# EAGLE design PowerCOnverter_v1.0 (EAGLE 8.0.0)
CNAME: ARL; DESIGNER: SHRIYA SHAH

## Sheet 1 of 2
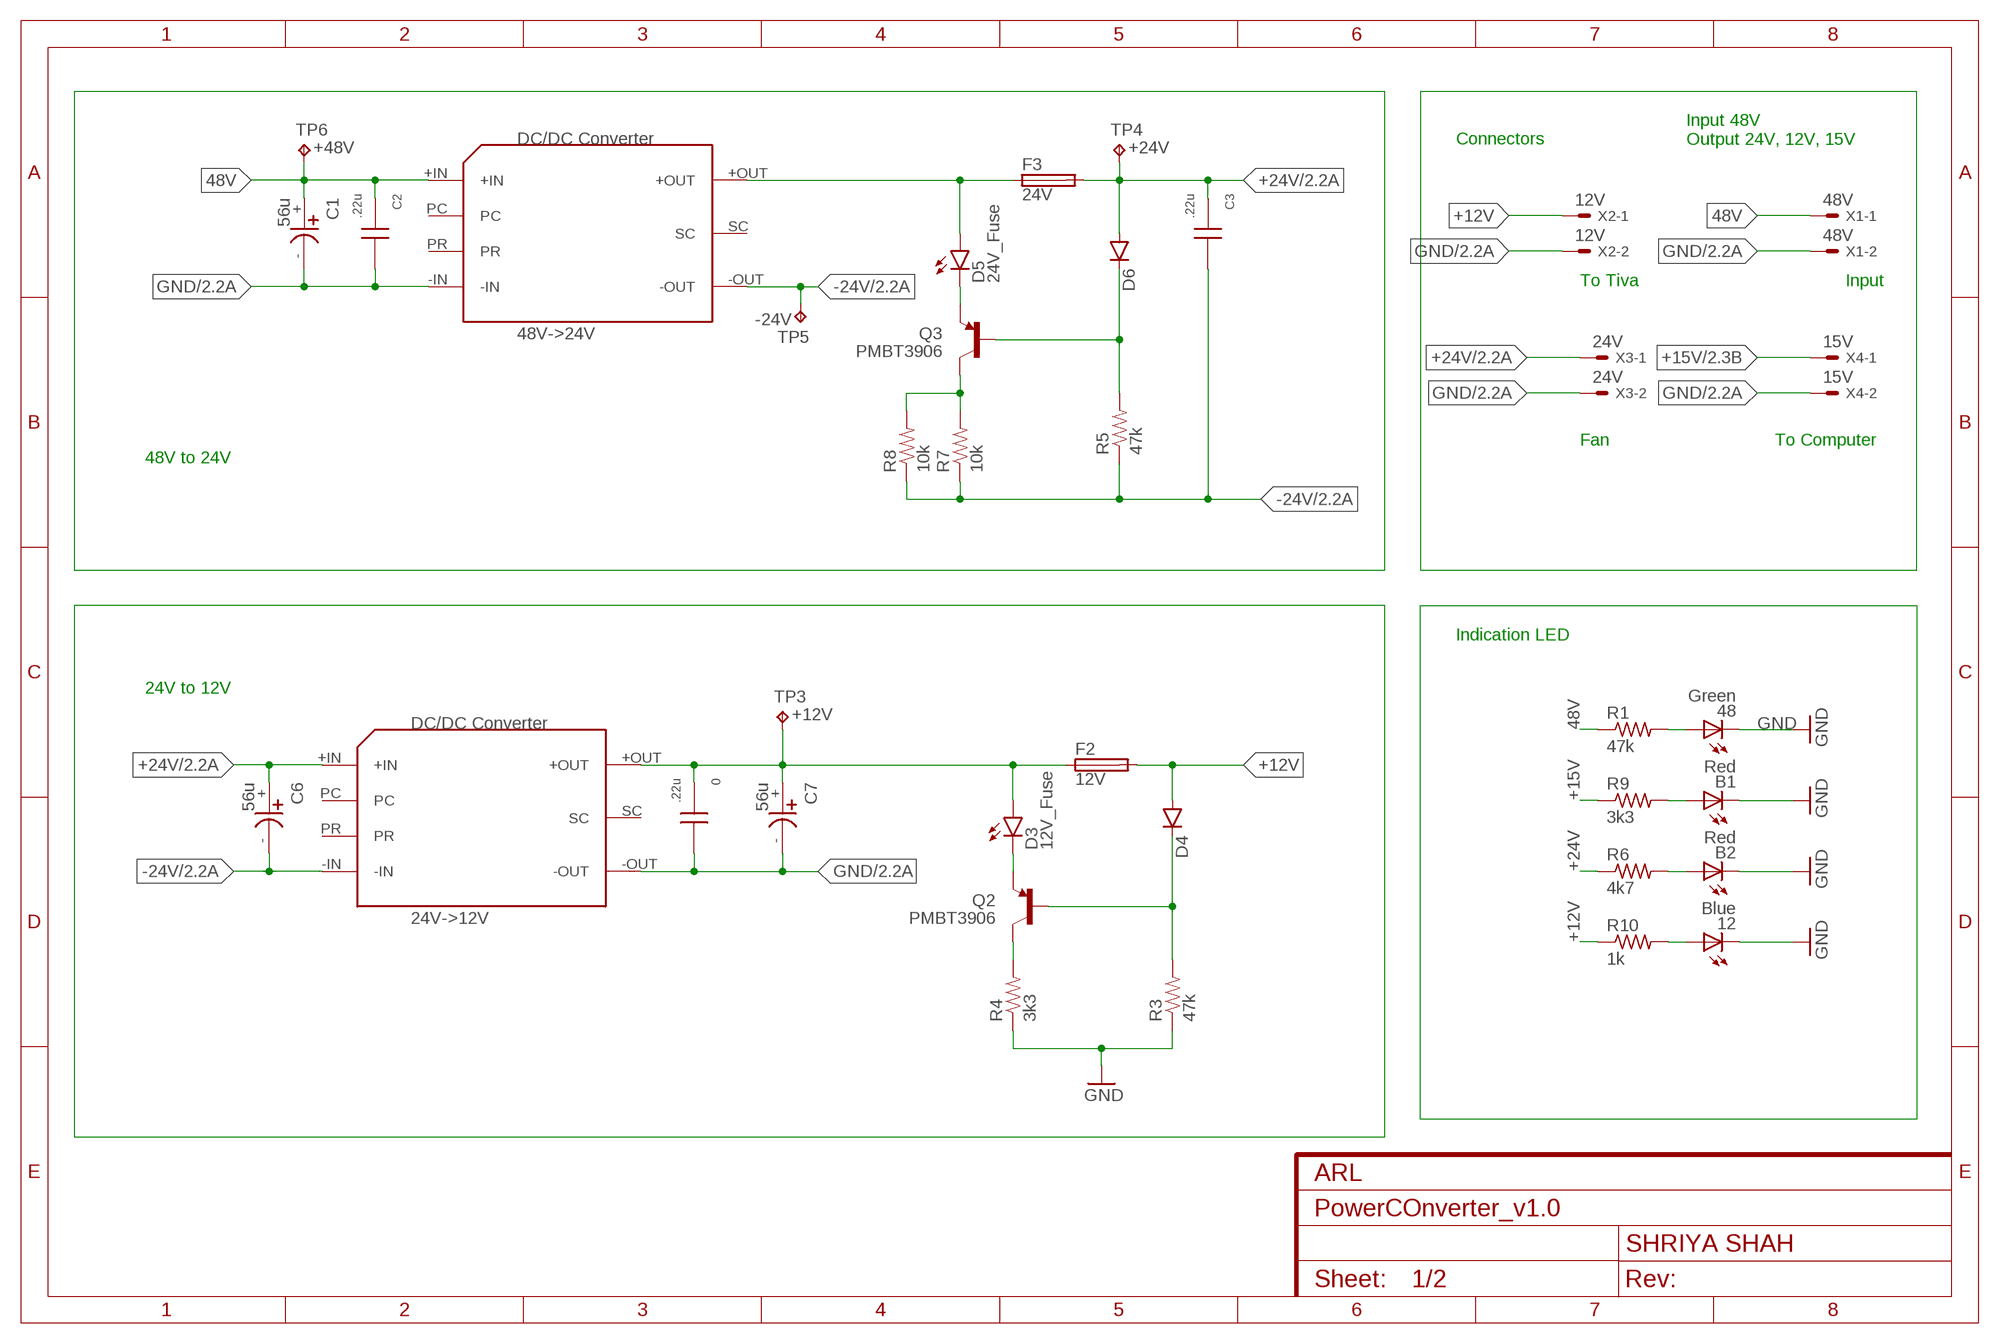
[diagram p0: schematic, sheet 1]

### Parts
0  .22u  .22U_100VDC_CERAMIC_CAP  [CERAMIC_CAP_5MM-LEAD]
12  Blue  LEDCHIPLED_1206  [CHIPLED_1206]
48  Green  LEDCHIPLED_1206  [CHIPLED_1206]
B1  Red  LEDCHIPLED_1206  [CHIPLED_1206]
B2  Red  LEDCHIPLED_1206  [CHIPLED_1206]
C1  56u  56U_100VDC_NICHICON  [CAP_5MM-LEAD-10MM-D]
C2  .22u  .22U_100VDC_CERAMIC_CAP  [CERAMIC_CAP_5MM-LEAD]
C3  .22u  .22U_100VDC_CERAMIC_CAP  [CERAMIC_CAP_5MM-LEAD]
C6  56u  56U_100VDC_NICHICON  [CAP_5MM-LEAD-10MM-D]
C7  56u  56U_100VDC_NICHICON  [CAP_5MM-LEAD-10MM-D]
D3  12V_Fuse  RED_LED_0603  [LED-0603]
D4  DIODESOD  [SOD-323]
D5  24V_Fuse  RED_LED_0603  [LED-0603]
D6  DIODESOD  [SOD-323]
F2  12V  FUSELITTLEFUSE_NANO  [LITTELFUSE_NANO]
F3  24V  FUSELITTLEFUSE_NANO  [LITTELFUSE_NANO]
PS1  48V->24V  VICOR_MICRO_DC/DC_24V  [VICOR_MICRO_DC/DC_CONVERTER]
PS2  24V->12V  VICOR_MICRO_DC/DC_12V  [VICOR_MICRO_DC/DC_CONVERTER]
Q2  PMBT3906  TRANSISTOR_PNPPMBT3906  [SOT23-3]
Q3  PMBT3906  TRANSISTOR_PNPPMBT3906  [SOT23-3]
R1  47k  R-US_M1206  [M1206]
R3  47k  47K_RESISTOR_0603  [0603-RES]
R4  3k3  3K3_RESISTOR_0603  [0603-RES]
R5  47k  47K_RESISTOR_0603  [0603-RES]
R6  4k7  R-US_M1206  [M1206]
R7  10k  10K_RESISTOR_0603  [0603-RES]
R8  10k  10K_RESISTOR_0603  [0603-RES]
R9  3k3  R-US_M1206  [M1206]
R10  1k  R-US_M1206  [M1206]
TP3  +12V  TP5000  [5000_SERIES_TESTPOINT]
TP4  +24V  TP5000  [5000_SERIES_TESTPOINT]
TP5  -24V  TP5000  [5000_SERIES_TESTPOINT]
TP6  +48V  TP5000  [5000_SERIES_TESTPOINT]
X1  48V  5566-2  [5566-2]
X2  12V  5566-2  [5566-2]
X3  24V  5566-2  [5566-2]
X4  15V  5566-2  [5566-2]

### Nets
48V: C1.+ C2.1 PS1.+IN R1.1 TP6.P$1(TP) X1.1
+12V: D4.A F2.2 R10.1 X2.1
+15V: R9.1 X4.1 ; also sheet 2
+24V: C3.1 C6.+ D6.A F3.2 PS2.+IN R6.1 TP4.P$1(TP) X3.1 ; also sheet 2
-24V: C3.2 C6.- PS1.-OUT PS2.-IN R5.1 R7.1 R8.1 TP5.P$1(TP) ; also sheet 2
GND: 0.2 12.C 48.C B1.C B2.C C1.- C2.2 C7.- PS1.-IN PS2.-OUT R3.1 R4.1 X1.2 X2.2 X3.2 X4.2 ; also sheet 2
N$1: D5.C Q3.2(E)
N$3: D5.A F3.1 PS1.+OUT
N$6: Q3.3(C) R7.2 R8.2
N$7: 48.A R1.2
N$8: 0.1 C7.+ D3.A F2.1 PS2.+OUT TP3.P$1(TP)
N$9: D3.C Q2.2(E)
N$10: Q2.3(C) R4.2
N$11: D4.C Q2.1(B) R3.2
N$12: D6.C Q3.1(B) R5.2
N$13: B1.A R9.2
N$14: B2.A R6.2
N$15: 12.A R10.2
Unconnected: PS1.PC PS1.PR PS1.SC PS2.PC PS2.PR PS2.SC

### Notes on the sheet
- Connectors
- Input 48V
  Output 24V, 12V, 15V
- To Tiva | Input
- Fan | To Computer
- 48V to 24V
- Indication LED
- 24V to 12V

## Sheet 2 of 2
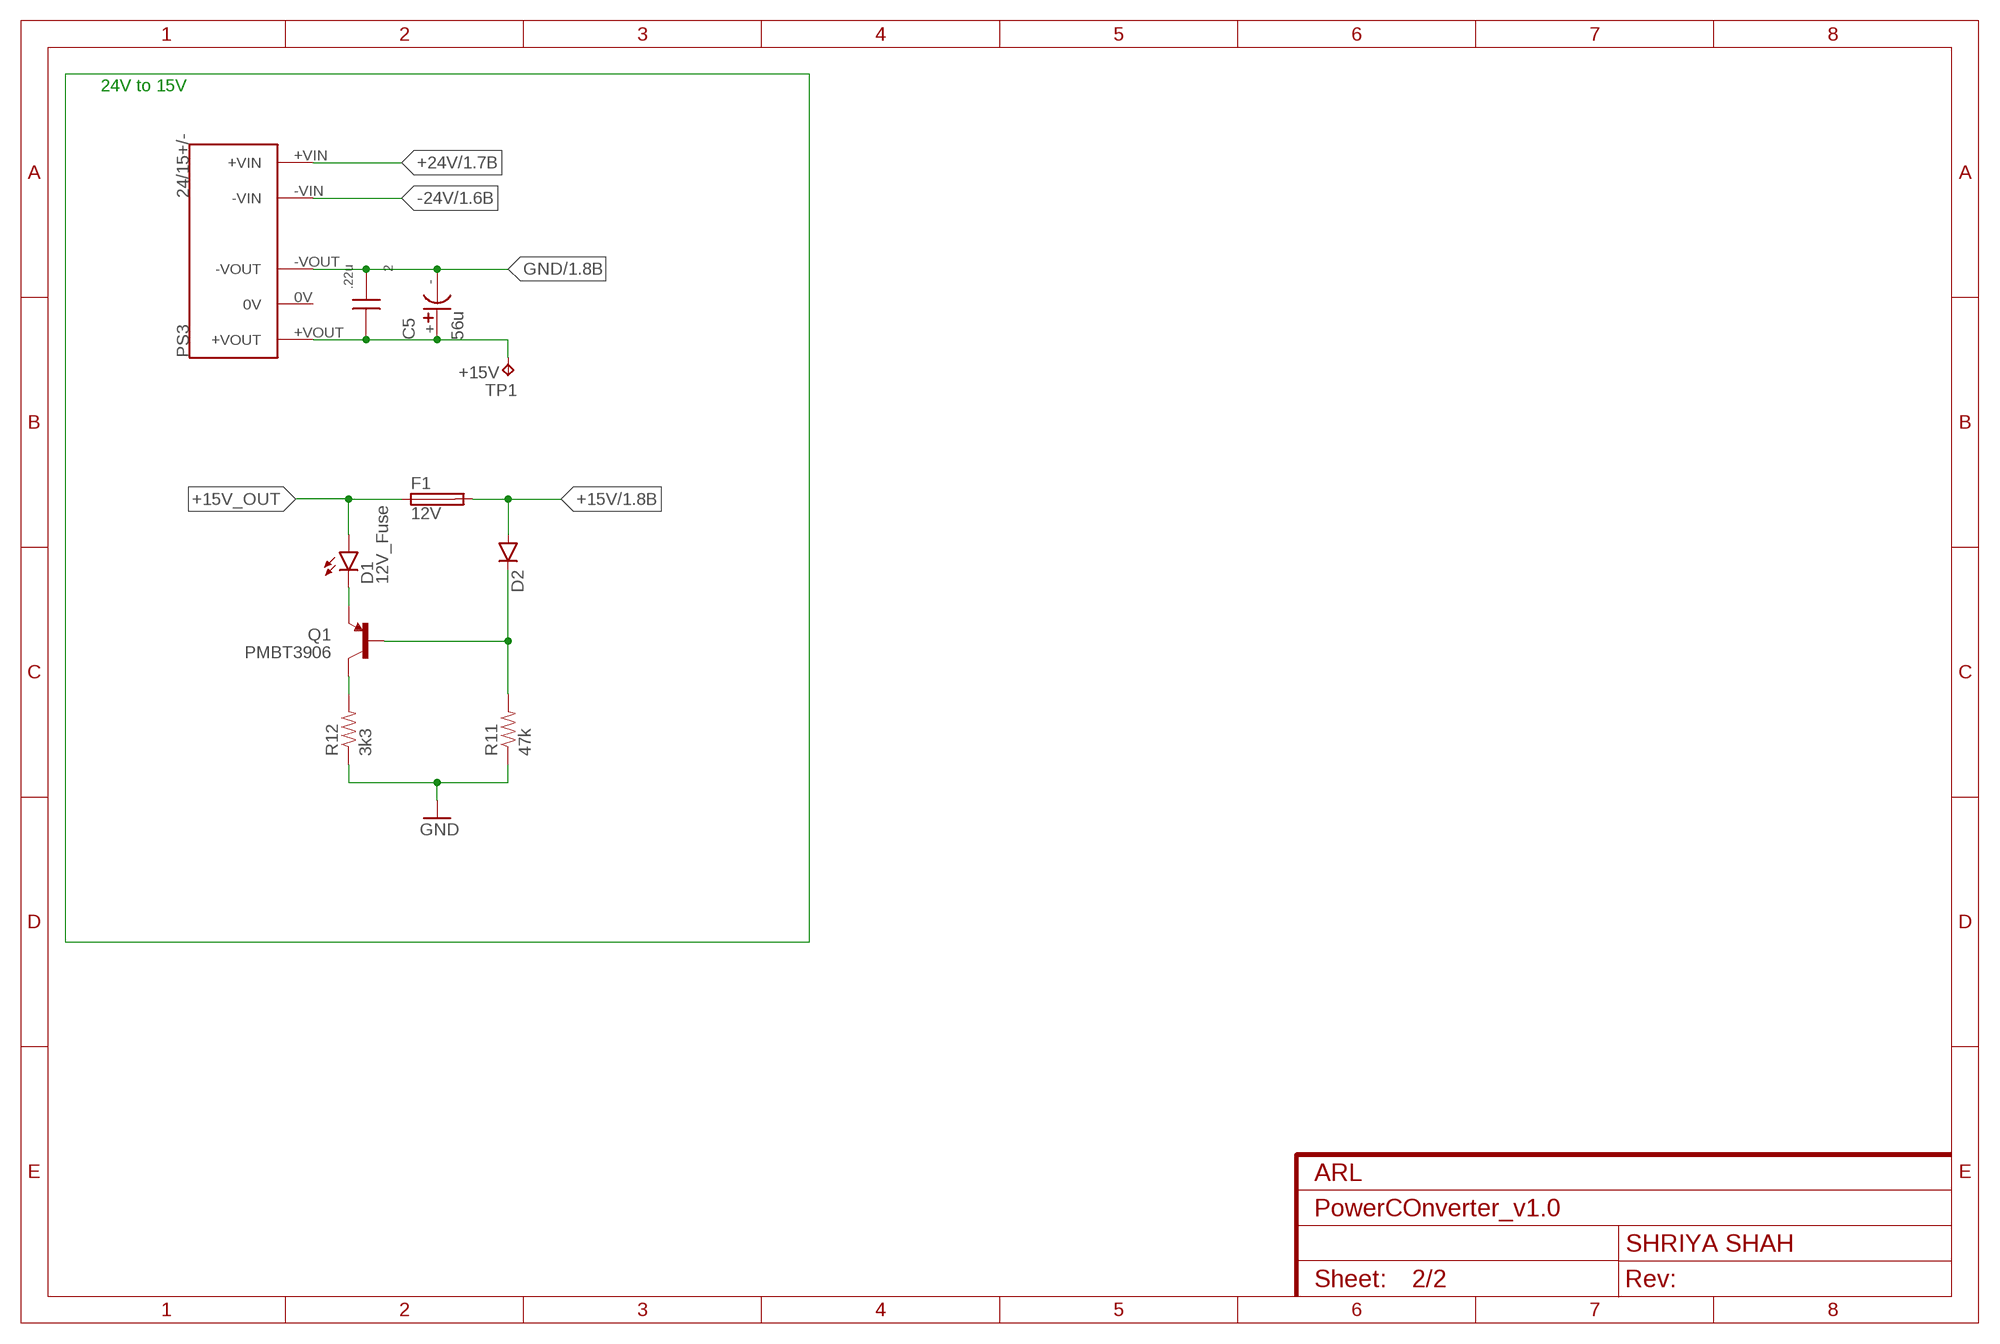
[diagram p1: schematic, sheet 2]

### Parts
2  .22u  .22U_100VDC_CERAMIC_CAP  [CERAMIC_CAP_5MM-LEAD]
C5  56u  56U_100VDC_NICHICON  [CAP_5MM-LEAD-10MM-D]
D1  12V_Fuse  RED_LED_0603  [LED-0603]
D2  DIODESOD  [SOD-323]
F1  12V  FUSELITTLEFUSE_NANO  [LITTELFUSE_NANO]
PS3  24/15+/-  MURATA_NMH2415SC  [MURATA_NMH]
Q1  PMBT3906  TRANSISTOR_PNPPMBT3906  [SOT23-3]
R11  47k  47K_RESISTOR_0603  [0603-RES]
R12  3k3  3K3_RESISTOR_0603  [0603-RES]
TP1  +15V  TP5000  [5000_SERIES_TESTPOINT]

### Nets
+15V: D2.A F1.2 ; also sheet 1
+15V_OUT: 2.2 C5.+ D1.A F1.1 PS3.+VOUT TP1.P$1(TP)
+24V: PS3.+VIN ; also sheet 1
-24V: PS3.-VIN ; also sheet 1
GND: 2.1 C5.- PS3.-VOUT R11.1 R12.1 ; also sheet 1
N$18: D1.C Q1.2(E)
N$19: Q1.3(C) R12.2
N$20: D2.C Q1.1(B) R11.2
Unconnected: PS3.0V

### Notes on the sheet
- 24V to 15V

## Library data of the parts
0 2 C2 C3 = Capacitor-IHMC:.22U_100VDC_CERAMIC_CAP: 0.22µF ±10% 100V X7R Ceramic Capacitor -55°C ~ 125°C Through Hole Radial 0.217" L x 0.138" W (5.50mm x 3.50mm); MPN: FK26X7R2A224K
12 48 B1 B2 = adafruit:LED: LED OSRAM: - CHIPLED LG R971, LG N971, LY N971, LG Q971, LY Q971, LO R971, LY R971 LH N974, LH R974 LS Q976, LO Q976, LY Q976 LO Q996 - Hyper CHIPLED LW Q18S LB Q993, LB Q99A, LB R99A - SideLED LS A670, LO A670, LY A670, LG A670, LP A670 LB A673, LV A673, LT A673, LW A673 LH A674 LY A675 LS A676, LA A676, LO A676, LY A676, LW A676 LS A679, LY A679, LG A679 - Hyper Micro SIDELED® LS Y876, LA Y876, LO Y876, LY Y876 LT Y87S - SmartLED LW L88C, LW L88S LB L89C, LB L89S, LG L890 LS L89K, LO L89K, LY L89K LS L896, LA L896, LO L896, LY L896 - TOPLED LS T670, LO T670, LY T670, LG T670, LP T670 LSG T670, LSP T670, LSY T670, LOP T670, LYG T670 LG T671, LOG T671, LSG T671 LB T673, LV T673, LT T673, LW T673 LH T674 LS T676, LA T676, LO T676, LY T676, LB T676, LH T676, LSB T676, LW T676 LB T67C, LV T67C, LT T67C, LS T67K, LO T67K, LY T67K, LW E67C LS E67B, LA E67B, LO E67B, LY E67B, LB E67C, LV E67C, LT E67C LW T67C LS T679, LY T679, LG T679 LS T770, LO T770, LY T770, LG T770, LP T770 LB T773, LV T773, LT T773, LW T773 LH T774 LS E675, LA E675, LY E675, LS T675 LS T776, LA T776, LO T776, LY T776, LB T776 LHGB T686 LT T68C, LB T68C - Hyper Mini TOPLED® LB M676 - Mini TOPLED Santana® LG M470 LS M47K, LO M47K, LY M47K Source: http://www.osram.convergy.de/
C1 C5-C7 = Capacitor-IHMC:56U_100VDC_NICHICON: Aluminum Electrolytic Capacitors - Leaded 56uF 105c 20%; LINK: http://bit.ly/1Y6Cm3r; MPN: UPJ2A560MPD1TD
D1 D3 D5 = test_Beast_Elmo_Twitter_Carrier_Board_V1:RED_LED_0603: LED RED DIFFUSED 0603 SMD; MPN: LS L296-P2Q2-1-Z
D2 D4 D6 = SparkFun-DiscreteSemi:DIODE: Diode These are standard reverse protection diodes and small signal diodes. SMA package can handle up to about 1A. SOD-323 can handle about 200mA. What the SOD-323 package when ordering, there are some mfgs out there that are 5-pin packages.; MPN: BAS16HT1G; PROD_ID: DIO-09646
F1-F3 = fuse:FUSE: Fuse Fuse Holder ACS NANO HLDR; MPN: 01550900M
PS1 = Vicor:VICOR_MICRO_DC/DC_24V: Isolated DC/DC Converters 24V 150W; MPN: V48C24C150BL
PS2 = Vicor:VICOR_MICRO_DC/DC_12V: Isolated DC/DC Converters Micro Family-Vin-24, Vout-12, Power-100; MPN: V24C12T100BL
PS3 = test_Beast_Elmo_Twitter_Carrier_Board_V1:MURATA_NMH2415SC: CONV DC/DC 2W 24VIN 15V SIP DL; MPN: NMH2415SC
Q1-Q3 = SparkFun-DiscreteSemi:TRANSISTOR_PNP: Generic PNP BJT Double check pinouts against datasheets- not all devices are the same! MMBT3906 - 40V 200mA SOT-23 (TRANS-08052) MMBT4403 - 40V 600mA SOT-23 (TRANS-09245); MPN: PMBT3906,215; PROD_ID: TRANS-08052
R1 R6 R9 R10 = adafruit:R-US_: RESISTOR, American symbol
R3 R5 R11 = test_Beast_Elmo_Twitter_Carrier_Board_V1:47K_RESISTOR_0603: RES SMD 47K OHM 5% 1/10W 0603; MPN: CRCW060347K0JNEA
R4 R12 = test_Beast_Elmo_Twitter_Carrier_Board_V1:3K3_RESISTOR_0603: RES SMD 3.3K OHM 1% 1/10W 0603; MPN: CRCW06033K30FKEA
R7 R8 = test_Beast_Elmo_Twitter_Carrier_Board_V1:10K_RESISTOR_0603: RES SMD 10K OHM 1% 1/10W 0603; MPN: CRCW060310K0FKEA
TP1 TP3-TP6 = testpad:TP: Test pad; COLOR: White; MPN: 5002
X1-X4 = con-molex:5566-2: Mini FIT connector 2 pol Source: http://www.molex.com; MF: Molex; MPN: 39-29-9023

## Board
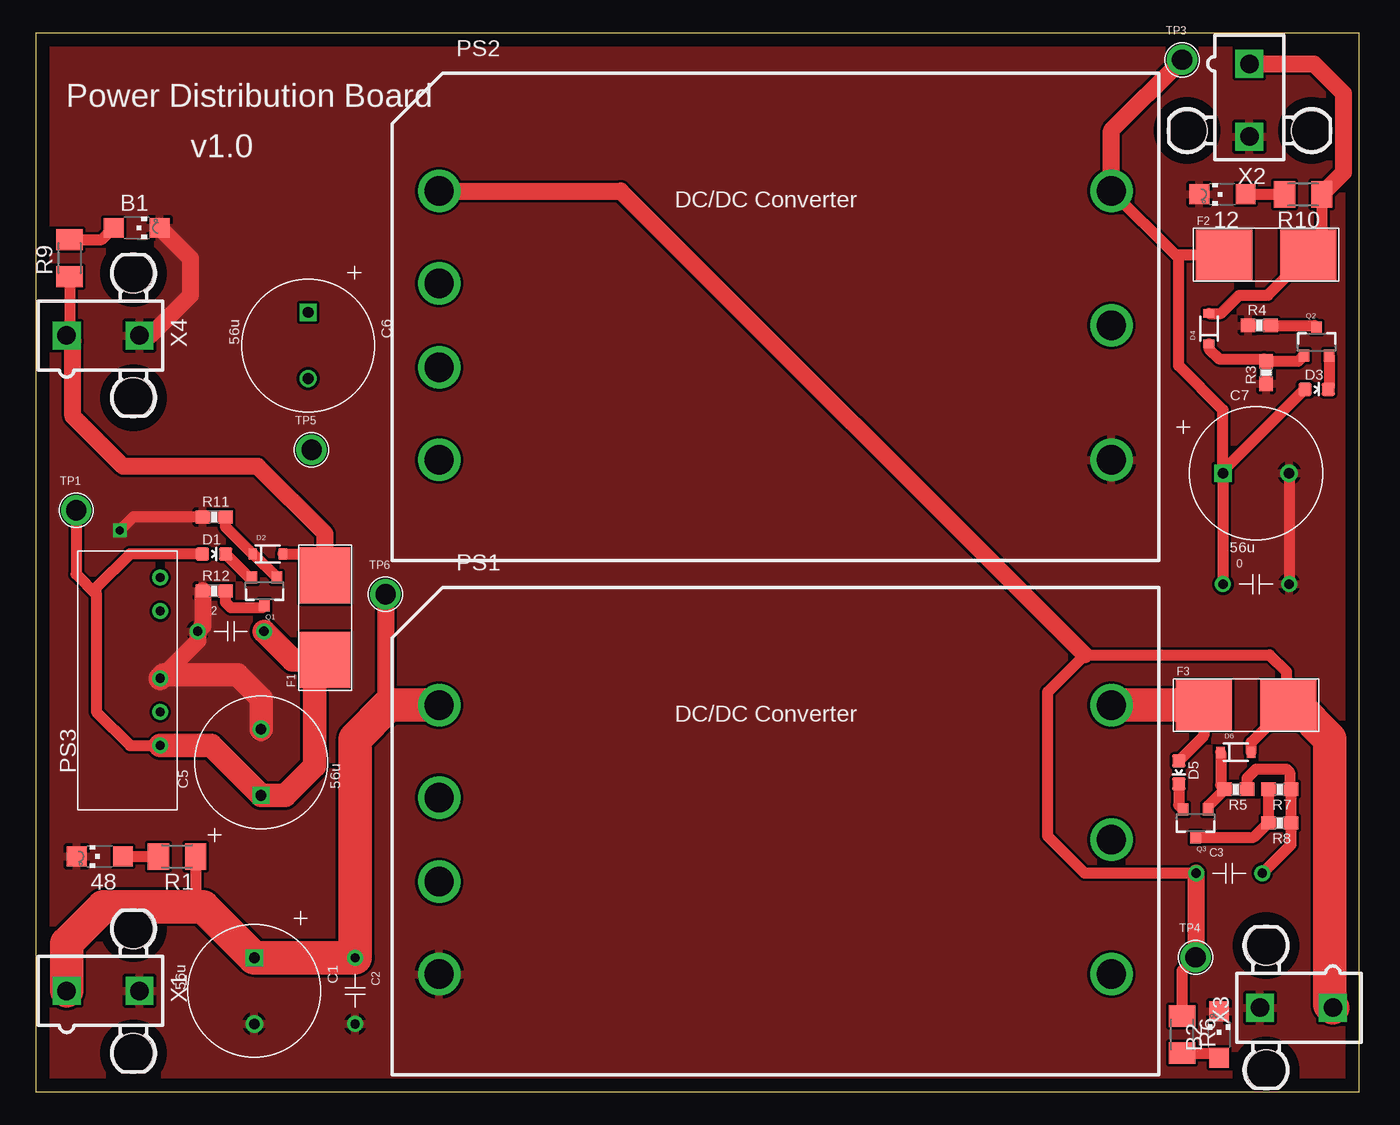
[diagram p2: board, top side]
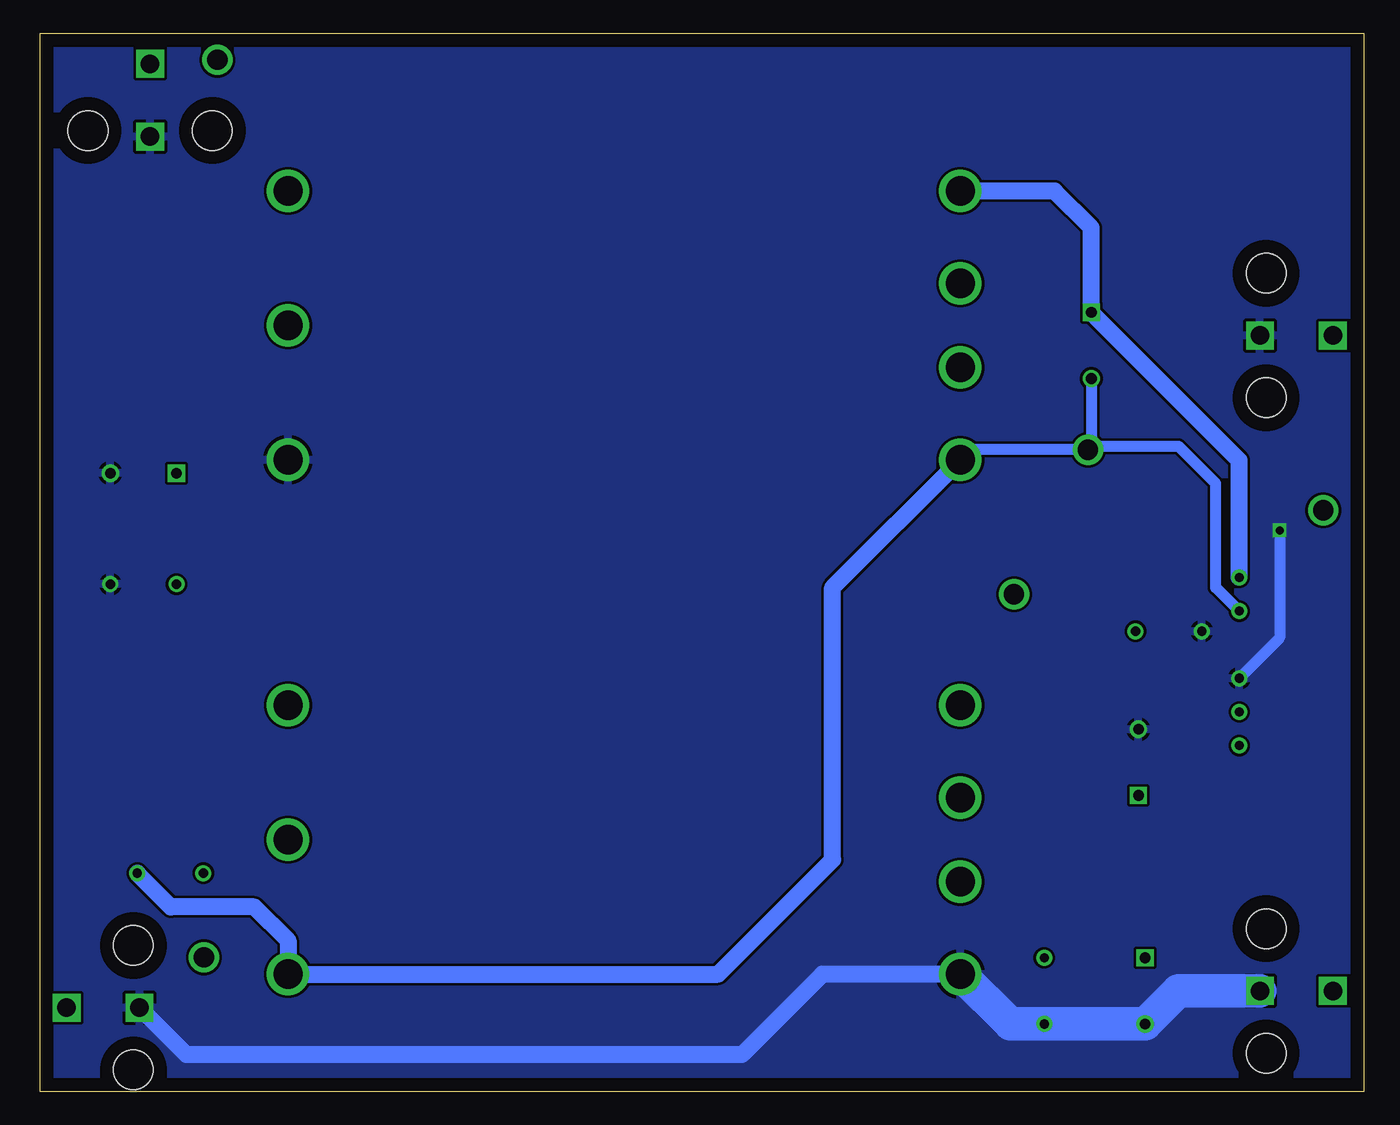
[diagram p3: board, bottom side, seen from below]

Size 100 x 80 mm. Coordinates in mm from the lower left corner, seen from the top.
Outline: 0,0 100,0 100,80 0,80 0,0
Copper layers (1*16): Top 0.035mm / dielectric 1.5mm / Bottom 0.035mm
Design rules "default": minimum track width 10mil, minimum drill 24mil, track to track 8mil, track to pad 8mil, pad to pad 8mil, via to via 8mil, smd to smd 8mil, copper to edge 40mil, drill to drill 8mil, minimum pad ring 10mil, minimum via ring 8mil, stop-mask expansion 4mil, vias tented up to drill 0mil, thermal gap 10mil

### Footprints (pad centres in the part's own frame; a part is rotated, then mirrored left to right if it is on the bottom)
CERAMIC_CAP_5MM-LEAD = drill 0.7: 1 -2.5,0; 2 2.5,0
CHIPLED_1206 = smd 1.5 x 1.5: A 0,-1.75; C 0,1.75
CAP_5MM-LEAD-10MM-D = drill 0.8 square: + -2.5,0 | drill 0.8: - 2.5,0
LED-0603 = smd 1 x 1: A 0,-0.877; C 0,0.877
SOD-323 = smd 0.63 x 0.83: A 1.15,0; C -1.15,0
LITTELFUSE_NANO = smd 4.245 x 3.81: 1 -3.188,0; 2 3.188,0
VICOR_MICRO_DC/DC_CONVERTER = drill 2.2: +IN 0,20.32; +OUT 50.8,20.32; -IN 0,0; -OUT 50.8,0; PC 0,13.335; PR 0,6.985; SC 50.8,10.16
MURATA_NMH = drill 0.7: 0V 10.16,0; +VIN 0,0; +VOUT 12.7,0; -VIN 2.54,0; -VOUT 7.62,0
SOT23-3 = smd 0.8 x 0.9: 1 -0.95,-1; 2 0.95,-1; 3 0,1.1
M1206 = smd 1.6 x 2: 1 -1.4,0; 2 1.4,0
0603-RES = smd 1.1 x 1: 1 -0.85,0; 2 0.85,0
5000_SERIES_TESTPOINT = drill 1.524 pad 2.032: P$1 0,0
5566-2 = drill 1.4 square: 1 0,-2.75; 2 0,2.75 | hole 3: 4.7,2.29; -4.7,2.29

### Placement (x,y rotation side)
0  92.2,38.35 0 top
2  14.73,34.8 0 top
12  89.66,67.82 90 top
48  4.83,17.78 90 top
B1  7.62,65.28 270 top
B2  89.41,4.32 0 top
C1  16.51,7.62 270 top
C2  24.13,7.62 270 top
C3  90.17,16.51 0 top
C5  17.02,24.89 90 top
C6  20.57,56.39 270 top
C7  92.2,46.74 0 top
D1  13.46,40.64 270 top
D2  17.53,40.64 0 top
D3  96.77,53.09 270 top
D4  88.65,57.66 90 top
D5  86.36,24.13 180 top
D6  90.68,25.65 0 top
F1  21.84,35.81 90 top
F2  92.96,63.25 0 top
F3  91.44,29.21 0 top
PS1  30.48,8.89 0 top
PS2  30.48,47.75 0 top
PS3  9.4,38.86 270 top
Q1  17.27,37.85 180 top
Q2  96.77,56.64 0 top
Q3  87.63,20.32 180 top
R1  10.67,17.78 180 top
R3  92.96,54.36 90 top
R4  92.46,57.91 0 top
R5  90.68,22.86 180 top
R6  86.61,4.32 270 top
R7  93.98,22.86 180 top
R8  93.98,20.32 180 top
R9  2.54,62.99 90 top
R10  95.76,67.82 180 top
R11  13.46,43.43 0 top
R12  13.46,37.85 0 top
TP1  3.05,43.94 0 top
TP3  86.61,77.98 0 top
TP4  87.63,10.16 0 top
TP5  20.83,48.51 0 top
TP6  26.42,37.59 0 top
X1  5.08,7.62 270 top
X2  91.69,74.93 180 top
X3  95.25,6.35 90 top
X4  5.08,57.15 270 top

### Tracks (layer width: path | path; a pad name or v marks a point on that pad's centre or on a via)
48V
  Top 0.813: R1.1 12.07,14.56 12.66,13.97
  Top 1.27: TP6.P$1 26.42,29.46 26.67,29.21
  Top 2.54: X1.1 2.33,11.22 5.08,13.97 12.66,13.97 C1.+ C2.1 24.13,26.67 26.67,29.21 PS1.+IN
+12V
  Top 0.813: D4.A 89.54,58.81 90.93,60.2 93.1,60.2 F2.2 97.16,64.25 R10.1
  Top 1.27: X2.1 96.56,77.68 98.81,75.44 98.81,69.47 R10.1
+15V
  Top 0.813: D2.A 20.21,40.64 F1.2 | R9.1 2.54,57.36 X4.1
  Top 1.27: F1.2 21.84,42.16 16.76,47.24 6.6,47.24 2.79,51.05 2.79,56.69 X4.1
+15V_OUT
  Top 0.813: D1.A 7.11,40.64 4.57,38.1 4.57,37.59 | 4.57,37.59 4.57,28.7 7.11,26.16 PS3.+VOUT | TP1.P$1 3.05,39.12 4.57,37.59
  Top 1.778: PS3.+VOUT 13.25,26.16 C5.+ 18.84,22.39 21.08,24.64 21.08,31.86 F1.1 19.4,32.63 2.2
+24V
  Top 0.813: D6.A 91.83,26.41 F3.2 94.49,29.35 94.49,31.75 93.22,33.02 79.25,33.02 76.45,30.23 76.45,19.3 79.25,16.51 C3.1 | R6.1 86.61,9.14 TP4.P$1
  Top 1.27: C3.1 87.67,10.2 TP4.P$1 | PS2.+IN 44.2,68.07 79.25,33.02
  Top 2.54: F3.2 95.25,29.21 97.79,26.67 97.79,6.56 X3.1
  Bottom 1.27: PS2.+IN 23.37,68.07 20.57,65.28 C6.+ 9.4,47.71 PS3.+VIN
-24V
  Top 0.813: C3.2 94.83,18.67 R8.1 R7.1 94.74,22.95 94.74,24.13 94.49,24.38 92.2,24.38 91.53,23.71 R5.1
  Bottom 0.813: PS3.-VIN 11.18,38.1 11.18,45.97 13.97,48.77 20.57,48.77 | 20.57,48.77 TP5.P$1 | C6.- 20.57,48.77 | 20.57,48.77 TP5.P$1 | TP5.P$1 29.72,48.51 PS2.-IN
  Bottom 1.27: C3.2 90.13,13.97 83.82,13.97 81.28,11.43 PS1.-OUT 48.77,8.89 40.13,17.53 40.13,38.1 PS2.-IN
GND  (via drill 0.6)
  Top 0.813: C7.- 0.2 | R11.1 7.37,43.43 v6.35,42.42
  Top 1.27: 9.65,31.5 12.23,34.08 2.1 12.61,35.18 R12.1 | X4.2 8.64,57.15 11.68,60.2 11.68,62.96 B1.C
  Top 1.778: C5.- 17.02,29.72 15.24,31.5 9.65,31.5 PS3.-VOUT
  Bottom 0.813: v6.35,42.42 6.35,34.29 PS3.-VOUT
  Bottom 1.27: PS1.-IN 40.89,8.89 46.99,2.79 88.94,2.79 X3.2
  Bottom 2.54: X1.2 14.01,7.62 C1.- C2.2 26.71,5.12 PS1.-IN
  pour Top: 0.25,79.76 100.08,79.76 100.08,-0.25 0.25,-0.25
  pour Bottom: 0.25,79.76 100.08,79.76 100.08,-0.25 0.25,-0.25
N$1
  Top 0.813: D5.C 86.36,21.64 Q3.2
N$3
  Top 0.813: F3.1 88.25,26.9 D5.A
  Top 2.54: PS1.+OUT F3.1 88.9,29.21
N$6
  Top 0.813: Q3.3 92.03,19.22 R8.2 R7.2
N$7
  Top 0.813: 48.A R1.2
N$8
  Top 0.813: 86.11,63.25 F2.1 | 86.11,63.25 PS2.+OUT | C7.+ 89.7,46.89 D3.A | C7.+ 89.7,51.52 86.36,54.86 86.36,62.99 86.11,63.25 | C7.+ 0.1
  Top 1.27: PS2.+OUT 81.28,72.64 TP3.P$1
N$9
  Top 0.813: Q2.2 97.72,53.16 D3.C
N$10
  Top 0.813: R4.2 96.6,57.91 Q2.3
N$11
  Top 0.813: D4.C 88.65,56.13 89.41,55.37 92.8,55.37 R3.2 95.39,55.21 Q2.1
N$12
  Top 0.813: Q3.1 88.58,21.61 R5.2 89.53,23.16 D6.C
N$13
  Top 0.813: R9.2 4.98,64.39 B1.A
N$14
  Top 0.813: R6.2 89.06,2.92 B2.A
N$15
  Top 0.813: 12.A R10.2
N$18
  Top 0.813: Q1.2 16.13,38.85 D1.C
N$19
  Top 0.813: R12.2 14.31,37 14.73,36.58 17.1,36.58 Q1.3
N$20
  Top 0.813: Q1.1 16.43,40.64 D2.C 14.31,42.7 R11.2

### Text on the board
tNames: Power Distribution Board | v1.0